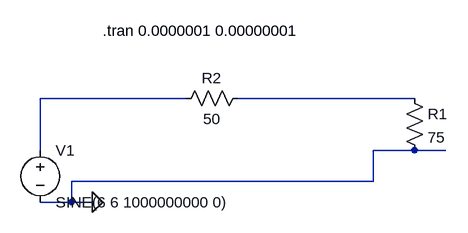
[diagram p0: schematic Draft49.asc]
Draft49.asc, the LTspice schematic file:
Version 4
SHEET 1 880 680
WIRE 384 304 160 304
WIRE 736 304 464 304
WIRE 160 384 160 304
WIRE 736 384 672 384
WIRE 784 384 736 384
WIRE 672 432 672 384
WIRE 672 432 208 432
WIRE 208 464 208 432
WIRE 208 464 160 464
WIRE 240 464 208 464
FLAG 240 464 0
SYMBOL voltage 160 368 R0
SYMATTR InstName V1
SYMATTR Value SINE(6 6 1000000000 0)
SYMBOL res 720 288 R0
SYMATTR InstName R1
SYMATTR Value 75
SYMBOL res 480 288 R90
WINDOW 0 0 56 VBottom 2
WINDOW 3 32 56 VTop 2
SYMATTR InstName R2
SYMATTR Value 50
TEXT 256 200 Left 2 !.tran 0.0000001 0.00000001

The netlist it stands for:
* Draft49.asc
V1 N001 0 SINE(6 6 1000000000 0)
R1 N002 0 75
R2 N002 N001 50
.tran 0.0000001 0.00000001
.backanno
.end